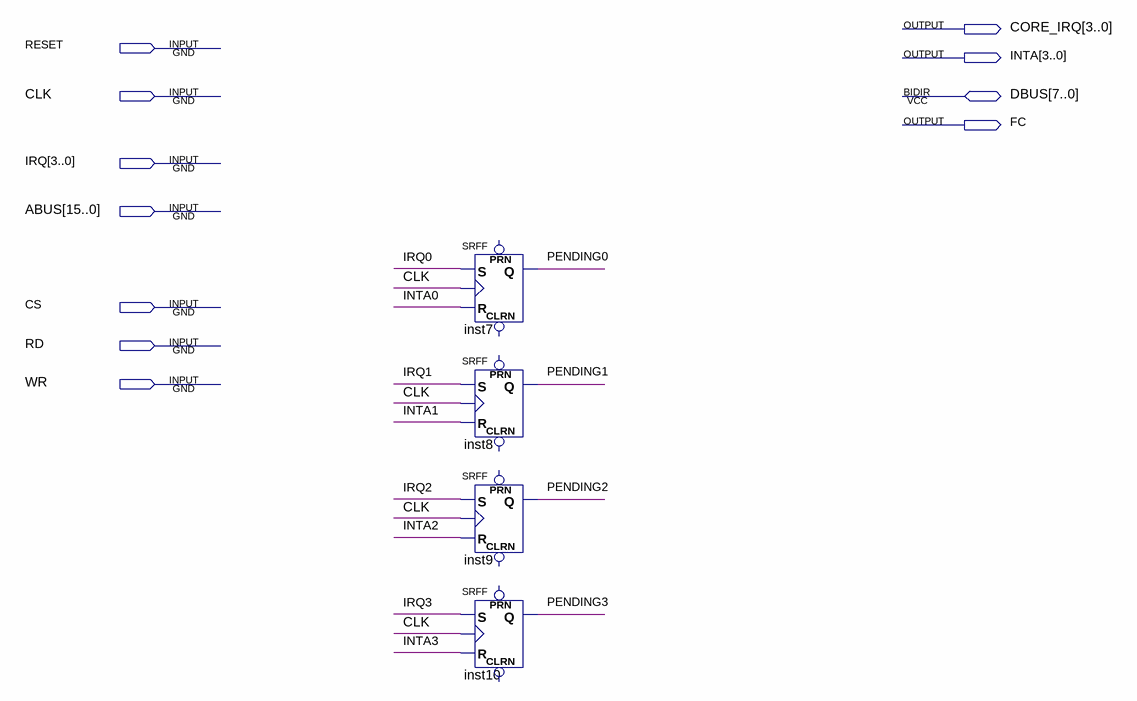
[diagram p0: schematic sheet]
// Quartus schematic PLIC.bdf as structural Verilog: 4 symbols, 11 pins
module PLIC (
  input  RESET,
  input  CLK,
  input  [3:0] IRQ,
  input  [15:0] ABUS,
  input  CS,
  input  RD,
  input  WR,
  inout  [7:0] DBUS,
  output [3:0] CORE_IRQ,
  output [3:0] INTA,
  output FC
);

  wire PENDING0, PENDING1, PENDING2, PENDING3;

  SRFF inst7 (.S(IRQ[0]), .R(INTA[0]), .CLK(CLK), .Q(PENDING0));  // open: PRN, CLRN
  SRFF inst8 (.S(IRQ[1]), .R(INTA[1]), .CLK(CLK), .Q(PENDING1));  // open: PRN, CLRN
  SRFF inst9 (.S(IRQ[2]), .R(INTA[2]), .CLK(CLK), .Q(PENDING2));  // open: PRN, CLRN
  SRFF inst10 (.S(IRQ[3]), .R(INTA[3]), .CLK(CLK), .Q(PENDING3));  // open: PRN, CLRN
endmodule
